# EAGLE design LCD (EAGLE 7.2.0)
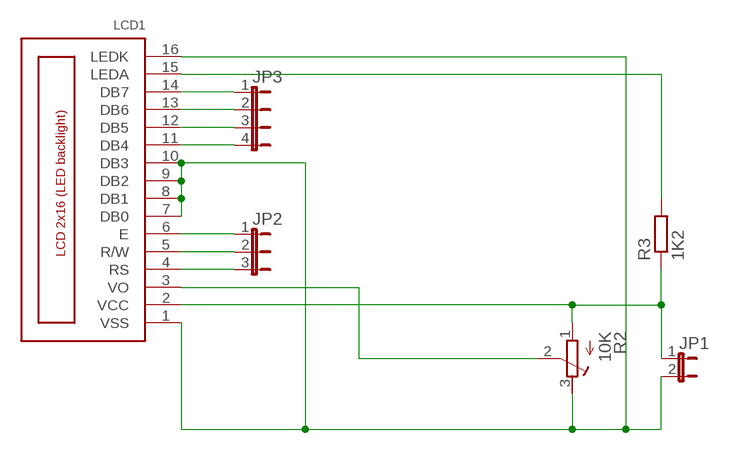
[diagram p0: schematic, sheet 1]

## Parts
JP1  JP1E  [JP1]
JP2  JP2E  [JP2]
JP3  JP4E  [JP4]
LCD1  LCD_2X16_SIL  [HY-1602F]
R2  10K  R-TRIMM3339P  [RTRIM3339P]
R3  1K2  R-EU_0207/10  [0207/10]

## Nets
N$1: JP1.1 LCD1.2(VCC) R2.1(A) R3.1
N$3: LCD1.15(LEDA) R3.2
N$7: LCD1.3(VO) R2.2(S)
N$8: JP1.2 LCD1.1(VSS) LCD1.7(DB0) LCD1.8(DB1) LCD1.9(DB2) LCD1.10(DB3) LCD1.16(LEDK) R2.3(E)
N$9: JP3.1 LCD1.14(DB7)
N$10: JP3.2 LCD1.13(DB6)
N$11: JP3.3 LCD1.12(DB5)
N$12: JP3.4 LCD1.11(DB4)
N$13: JP2.1 LCD1.6(E)
N$14: JP2.2 LCD1.5(R/W)
N$15: JP2.3 LCD1.4(RS)

## Library data of the parts
JP1 = jumper:JP1E: JUMPER
JP2 = jumper:JP2E: JUMPER
JP3 = jumper:JP4E: JUMPER
LCD1 = lcd_2x16_HD44780_led_backlight:LCD_2X16_SIL
R2 = rcl:R-TRIMM: Trimm resistor
R3 = resistor:R-EU_: RESISTOR, European symbol

## Board
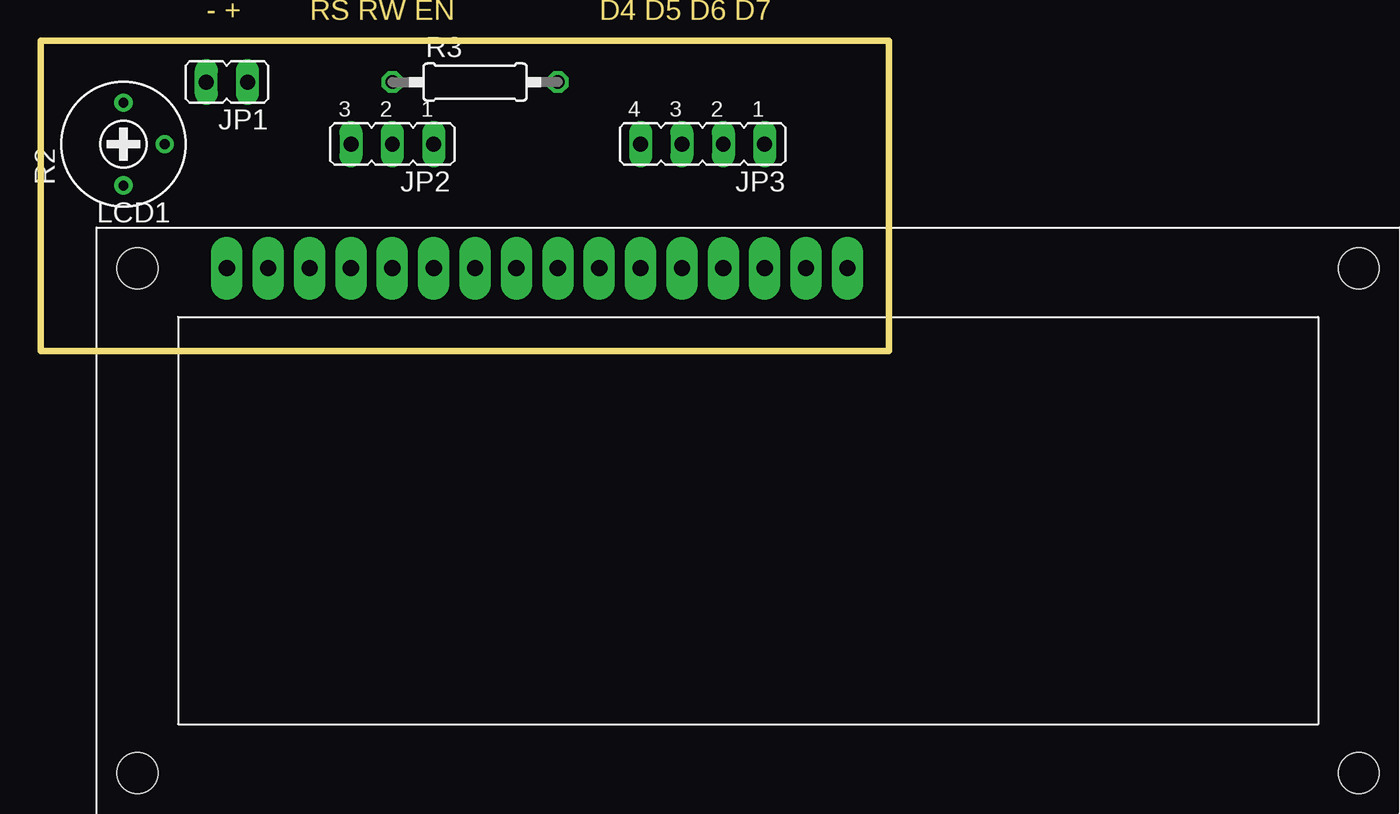
[diagram p1: board, top side]
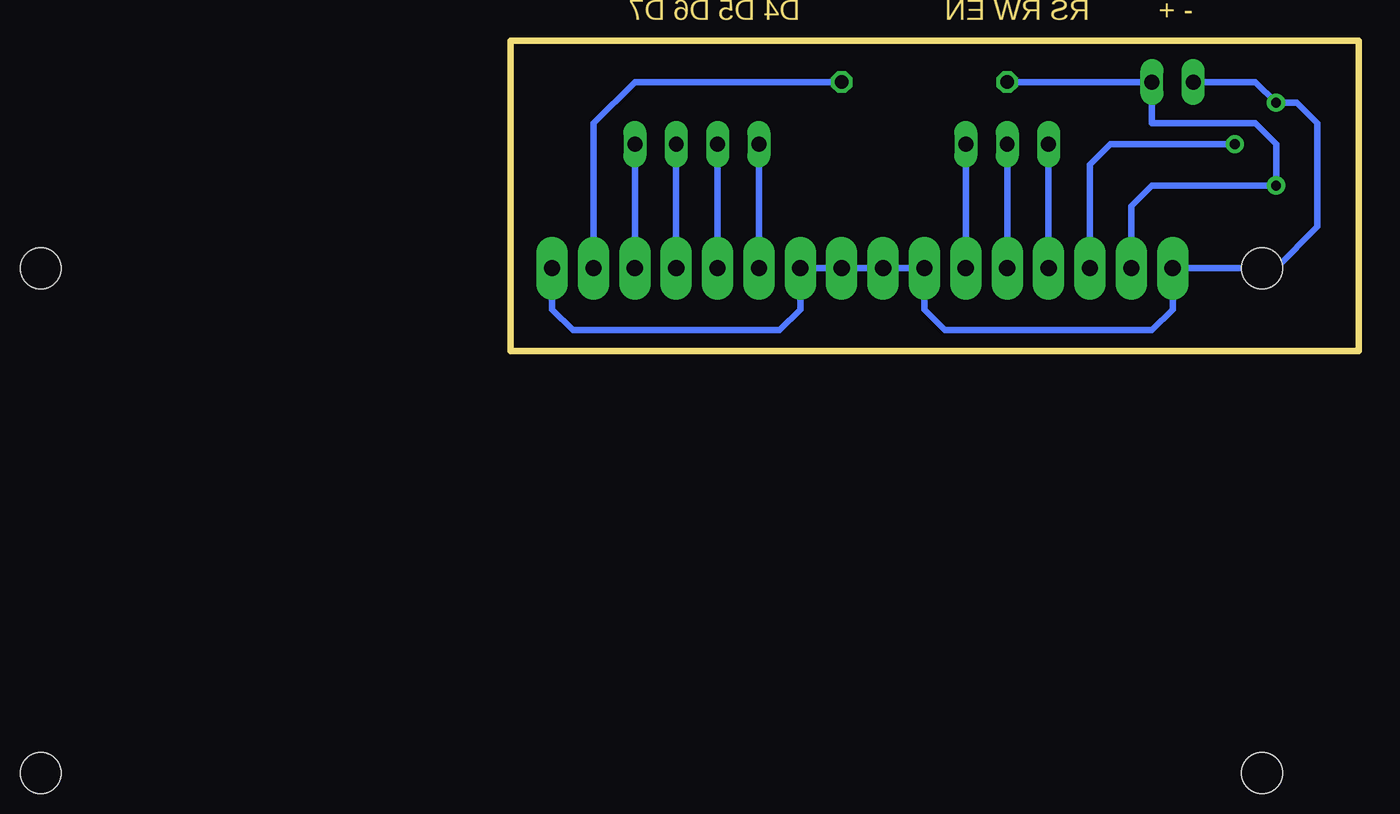
[diagram p2: board, bottom side, seen from below]

Size 52.07 x 19.05 mm. Coordinates in mm from the lower left corner, seen from the top.
Outline: 52.07,0 0,0 0,19.05 52.07,19.05 52.07,0
Copper layers (1*16): Top 0.035mm / dielectric 1.5mm / Bottom 0.035mm
Design rules "default": minimum track width 10mil, minimum drill 24mil, track to track 8mil, track to pad 8mil, pad to pad 8mil, via to via 8mil, smd to smd 8mil, copper to edge 40mil, drill to drill 8mil, minimum pad ring 10mil, minimum via ring 8mil, stop-mask expansion 4mil, vias tented up to drill 0mil, thermal gap 10mil

### Footprints (pad centres in the part's own frame; a part is rotated, then mirrored left to right if it is on the bottom)
JP1 = drill 0.914 long: 1 0,-1.27; 2 0,1.27
JP2 = drill 0.914 long: 1 -2.54,0; 2 0,0; 3 2.54,0
JP4 = drill 0.914 long: 1 -3.81,0; 2 -1.27,0; 3 1.27,0; 4 3.81,0
HY-1602F = drill 1 pad 1.93 long: 1 2.54,0; 2 5.08,0; 3 7.62,0; 4 10.16,0; 5 12.7,0; 6 15.24,0; 7 17.78,0; 8 20.32,0; 9 22.86,0; 10 25.4,0; 11 27.94,0; 12 30.48,0; 13 33.02,0; 14 35.56,0; 15 38.1,0; 16 40.64,0 | hole 2.5: -2.96,0; 72.04,0; -2.96,-31; 72.04,-31
RTRIM3339P = drill 0.61: 1 -2.54,0; 2 0,-2.54; 3 2.54,0
0207/10 = drill 0.813 octagon: 1 -5.08,0; 2 5.08,0

### Placement (x,y rotation side)
JP1  11.43,16.51 90 top
JP2  21.59,12.7 180 top
JP3  40.64,12.7 180 top
LCD1  8.89,5.08 0 top
R2  5.08,12.7 90 top
R3  26.67,16.51 0 top

### Tracks (layer width: path | path; a pad name or v marks a point on that pad's centre or on a via)
N$1
  Bottom 0.406: R3.1 JP1.1 12.7,13.97 6.35,13.97 5.08,12.7 R2.1 12.7,10.16 13.97,8.89 LCD1.2
N$3
  Bottom 0.406: R3.2 44.45,16.51 46.99,13.97 LCD1.15
N$7
  Bottom 0.406: R2.2 15.24,12.7 16.51,11.43 LCD1.3
N$8
  Bottom 0.406: LCD1.16 49.53,2.54 48.26,1.27 35.56,1.27 34.29,2.54 LCD1.10 LCD1.9 LCD1.8 LCD1.7 26.67,2.54 25.4,1.27 12.7,1.27 11.43,2.54 LCD1.1 5.08,5.08 2.54,7.62 2.54,13.97 3.81,15.24 R2.3 6.35,16.51 JP1.2
N$9
  Bottom 0.406: JP3.1 LCD1.14
N$10
  Bottom 0.406: JP3.2 LCD1.13
N$11
  Bottom 0.406: JP3.3 LCD1.12
N$12
  Bottom 0.406: JP3.4 LCD1.11
N$13
  Bottom 0.406: JP2.1 LCD1.6
N$14
  Bottom 0.406: JP2.2 LCD1.5
N$15
  Bottom 0.406: JP2.3 LCD1.4

### Text on the board
Dimension: - + | RS RW EN | D4 D5 D6 D7